# EAGLE design Beta22 (EAGLE 7.4.0)
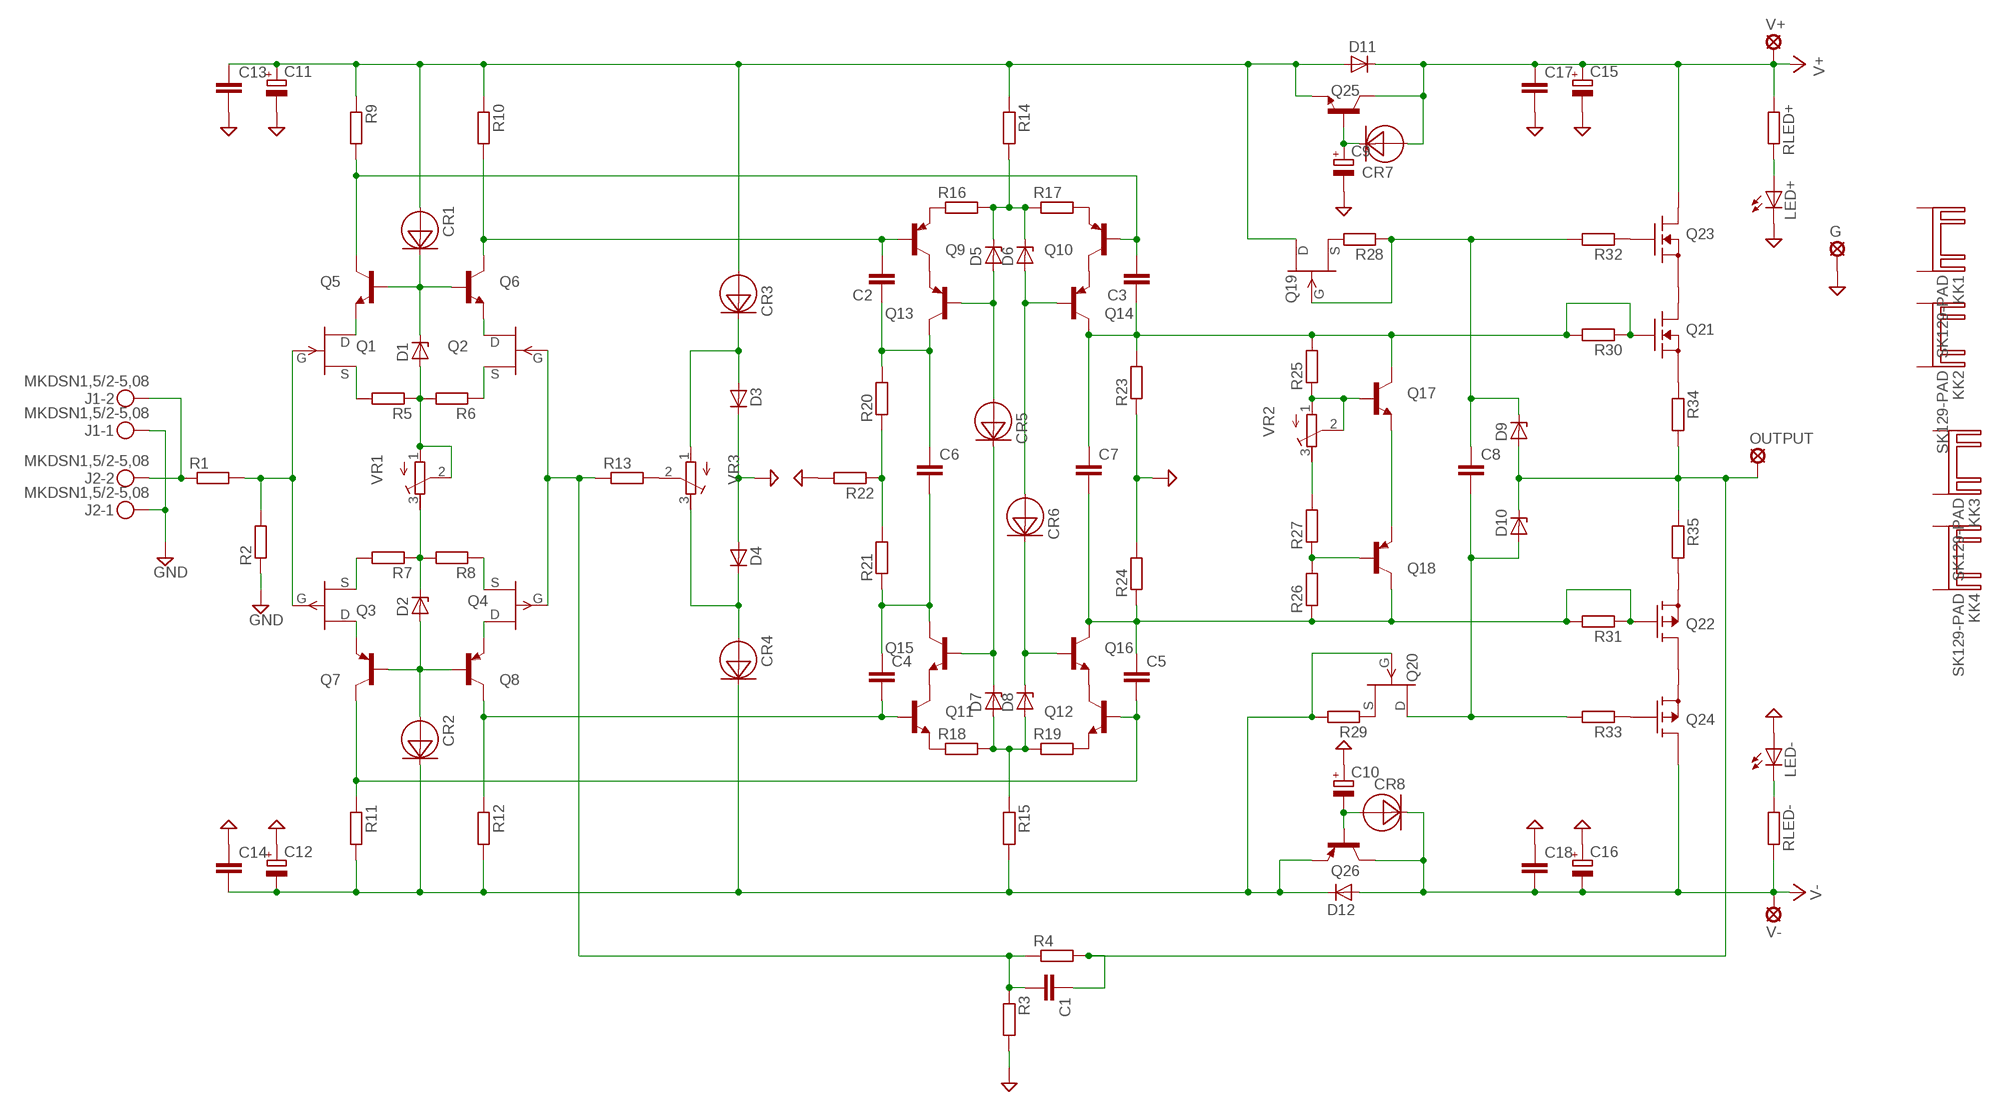
[diagram p0: schematic, sheet 1]

## Parts
C1  C-EU025_050-025X075  [C025_050-025X075]
C2  C-EU025_050-025X075  [C025_050-025X075]
C3  C-EU025_050-025X075  [C025_050-025X075]
C4  C-EU025_050-025X075  [C025_050-025X075]
C5  C-EU025_050-025X075  [C025_050-025X075]
C6  C-EU050-055X075  [C050-055X075]
C7  C-EU050-055X075  [C050-055X075]
C8  C-EU050-055X075  [C050-055X075]
C9  CPOL-EUE5-13  [E5-13]
C10  CPOL-EUE5-13  [E5-13]
C11  CPOL-EUE5-13  [E5-13]
C12  CPOL-EUE5-13  [E5-13]
C13  C-EU050-055X075  [C050-055X075]
C14  C-EU050-055X075  [C050-055X075]
C15  CPOL-EUE7.5-18  [E7,5-18]
C16  CPOL-EUE7.5-18  [E7,5-18]
C17  C-EU050-055X075  [C050-055X075]
C18  C-EU050-055X075  [C050-055X075]
CR1  E-202  [DO-35-3]
CR2  E-202  [DO-35-3]
CR3  E-202  [DO-35-3]
CR4  E-202  [DO-35-3]
CR5  E-202  [DO-35-3]
CR6  E-202  [DO-35-3]
CR7  E-202  [DO-35-3]
CR8  E-202  [DO-35-3]
D1  BZV10  [DO34Z7]
D2  BZV10  [DO34Z7]
D3  1N4148-V  [1N4148]
D4  1N4148-V  [1N4148]
D5  BZV10  [DO34Z7]
D6  BZV10  [DO34Z7]
D7  BZV10  [DO34Z7]
D8  BZV10  [DO34Z7]
D9  BZV10  [DO34Z7]
D10  BZV10  [DO34Z7]
D11  1N4148-V  [1N4148]
D12  1N4148-V  [1N4148]
G  SE14  [SE14]
J1  MKDSN1,5/2-5,08  [MKDSN1,5/2-5,08]
J2  MKDSN1,5/2-5,08  [MKDSN1,5/2-5,08]
KK1  SK129-PAD  [SK129]
KK2  SK129-PAD  [SK129]
KK3  SK129-PAD  [SK129]
KK4  SK129-PAD  [SK129]
LED+  LED5MM  [LED5MM]
LED-  LED5MM  [LED5MM]
OUTPUT  SE14  [SE14]
Q1  2SK170  [TO92-]
Q2  2SK170  [TO92-]
Q3  2SJ74BL  [TO92-]
Q4  2SJ74BL  [TO92-]
Q5  BC550  [TO92-EBC]
Q6  BC550  [TO92-EBC]
Q7  BC560  [TO92_1]
Q8  BC560  [TO92_1]
Q9  BC560  [TO92_1]
Q10  BC560  [TO92_1]
Q11  BC550  [TO92-EBC]
Q12  BC550  [TO92-EBC]
Q13  BC560  [TO92_1]
Q14  BC560  [TO92_1]
Q15  BC550  [TO92-EBC]
Q16  BC550  [TO92-EBC]
Q17  BC550  [TO92-EBC]
Q18  BC560  [TO92_1]
Q19  PN4392  [TO92-]
Q20  PN4392  [TO92-]
Q21  IRFZ24N  [TO220V]
Q22  IRFZ34N  [TO220V]
Q23  IRFZ24N  [TO220V]
Q24  IRFZ34N  [TO220V]
Q25  BC550  [TO92-EBC]
Q26  BC560  [TO92_1]
R1  R-EU_0309/10  [0309/10]
R2  R-EU_0309/10  [0309/10]
R3  R-EU_0309/10  [0309/10]
R4  R-EU_0309/10  [0309/10]
R5  R-EU_0309/10  [0309/10]
R6  R-EU_0309/10  [0309/10]
R7  R-EU_0309/10  [0309/10]
R8  R-EU_0309/10  [0309/10]
R9  R-EU_0309/10  [0309/10]
R10  R-EU_0309/10  [0309/10]
R11  R-EU_0309/10  [0309/10]
R12  R-EU_0309/10  [0309/10]
R13  R-EU_0309/10  [0309/10]
R14  R-EU_0309/10  [0309/10]
R15  R-EU_0309/10  [0309/10]
R16  R-EU_0309/10  [0309/10]
R17  R-EU_0309/10  [0309/10]
R18  R-EU_0309/10  [0309/10]
R19  R-EU_0309/10  [0309/10]
R20  R-EU_0309/10  [0309/10]
R21  R-EU_0309/10  [0309/10]
R22  R-EU_0309/10  [0309/10]
R23  R-EU_0309/10  [0309/10]
R24  R-EU_0309/10  [0309/10]
R25  R-EU_0309/10  [0309/10]
R26  R-EU_0309/10  [0309/10]
R27  R-EU_0309/10  [0309/10]
R28  R-EU_0309/10  [0309/10]
R29  R-EU_0309/10  [0309/10]
R30  R-EU_0309/10  [0309/10]
R31  R-EU_0309/10  [0309/10]
R32  R-EU_0309/10  [0309/10]
R33  R-EU_0309/10  [0309/10]
R34  R-EU_0617/17  [0617/17]
R35  R-EU_0617/17  [0617/17]
RLED+  R-EU_0309/10  [0309/10]
RLED-  R-EU_0309/10  [0309/10]
V+  SE14  [SE14]
V-  SE14  [SE14]
VR1  R-TRIMM3296W  [RTRIM3296W]
VR2  R-TRIMM3296W  [RTRIM3296W]
VR3  R-TRIMM3296W  [RTRIM3296W]

## Nets
GND: C9.- C10.+ C11.- C12.+ C13.2 C14.1 C15.- C16.+ C17.2 C18.1 D3.C D4.A G.MP J1.1 J2.1 LED+.K(C) LED-.A R2.1 R3.2 R22.2 R23.1 R24.2
N$1: Q1.2(G) Q3.2(G) R1.2 R2.2
N$2: Q2.1(D) Q6.E
N$3: Q1.3(S) R5.2
N$4: Q3.3(S) R7.2
N$5: Q1.1(D) Q5.E
N$6: Q3.1(D) Q7.3(E)
N$7: Q2.3(S) R6.1
N$8: D2.C R7.1 R8.2 VR1.3(E)
N$9: Q4.3(S) R8.1
N$10: Q4.1(D) Q8.3(E)
N$11: D1.A R5.1 R6.2 VR1.1(A) VR1.2(S)
N$12: CR2.ANODE D2.A Q7.2(B) Q8.2(B)
N$13: C3.2 C3.3 Q5.C Q10.2(B) R9.2
N$14: C2.2 C2.3 Q6.C Q9.2(B) R10.2
N$15: CR4.ANODE D4.C VR3.3(E)
N$16: CR1.1(CATHODE) CR1.2(CATHODE) CR1.CATHODE D1.C Q5.B Q6.B
N$17: C12.- C14.2 CR2.1(CATHODE) CR2.2(CATHODE) CR2.CATHODE CR4.1(CATHODE) CR4.2(CATHODE) CR4.CATHODE D12.C Q20.1(G) Q26.3(E) R11.2 R12.2 R15.2 R29.2
N$18: C5.2 C5.3 Q7.1(C) Q12.B R11.1
N$19: J1.2 J2.2 R1.1
N$20: C8.2 D10.A Q20.3(D) R33.2
N$21: C1.2 C1.3 Q2.2(G) Q4.2(G) R3.1 R4.1 R13.1
N$22: R13.2 VR3.2(S)
N$23: Q9.1(C) Q13.3(E)
N$24: CR3.1(CATHODE) CR3.2(CATHODE) CR3.CATHODE D3.A VR3.1(A)
N$25: Q10.1(C) Q14.3(E)
N$26: C1.1 D9.A D10.C OUTPUT.MP R4.2 R34.2 R35.1
N$27: Q9.3(E) R16.1
N$28: Q10.3(E) R17.2
N$29: D5.C D6.C R14.2 R16.2 R17.1
N$30: Q11.E R18.1
N$31: Q12.E R19.2
N$32: D7.A D8.A R15.1 R18.2 R19.1
N$33: C4.2 C4.3 Q8.1(C) Q11.B R12.1
N$34: R20.1 R21.2 R22.1
N$35: C2.1 C6.1 Q13.1(C) R20.2
N$36: C4.1 C6.2 Q15.C R21.1
N$37: Q11.C Q15.E
N$38: Q12.C Q16.E
N$39: Q17.B R25.1 VR2.1(A) VR2.2(S)
N$40: Q19.2(S) R28.2
N$41: Q20.2(S) R29.1
N$42: C3.1 C7.1 Q14.1(C) Q17.C Q21.1(G) R23.2 R25.2 R30.1 R30.2
N$43: CR5.ANODE D5.A Q13.2(B)
N$44: CR6.ANODE D6.A Q14.2(B)
N$45: CR5.1(CATHODE) CR5.2(CATHODE) CR5.CATHODE D7.C Q15.B
N$46: CR6.1(CATHODE) CR6.2(CATHODE) CR6.CATHODE D8.C Q16.B
N$47: Q18.2(B) R26.2 R27.1
N$48: R27.2 VR2.3(E)
N$49: Q17.E Q18.3(E)
N$50: C5.1 C7.2 Q16.C Q18.1(C) Q22.1(G) R24.1 R26.1 R31.1 R31.2
N$51: C11.+ C13.1 CR1.ANODE CR3.ANODE D11.A Q19.3(D) Q25.E R9.1 R10.1 R14.1
N$52: C10.- CR8.ANODE Q26.2(B)
N$54: C8.1 D9.C Q19.1(G) R28.1 R32.2
N$57: Q21.2(D) Q23.3(S)
N$58: Q22.2(D) Q24.3(S)
N$59: Q23.1(G) R32.1
N$60: Q24.1(G) R33.1
N$61: LED+.A RLED+.2
N$62: Q21.3(S) R34.1
N$63: Q22.3(S) R35.2
N$66: C9.+ CR7.1(CATHODE) CR7.2(CATHODE) CR7.CATHODE Q25.B
N$67: LED-.K(C) RLED-.1
V+: C15.+ C17.1 CR7.ANODE D11.C Q23.2(D) Q25.C RLED+.1 V+.MP
V-: C16.- C18.2 CR8.1(CATHODE) CR8.2(CATHODE) CR8.CATHODE D12.A Q24.2(D) Q26.1(C) RLED-.2 V-.MP
Unconnected: KK1.A2,5(K) KK1.B2,5(K) KK2.A2,5(K) KK2.B2,5(K) KK3.A2,5(K) KK3.B2,5(K) KK4.A2,5(K) KK4.B2,5(K)

## Library data of the parts
C1-C8 C13 C14 C17 C18 = Vwvwbg:C-EU: CAPACITOR, European symbol
C9-C12 C15 C16 = Vwvwbg:CPOL-EU: POLARIZED CAPACITOR, European symbol
CR1-CR8 = crd:E-202
D1 D2 D5-D10 = diode:BZV10: Z DIODE
D3 D4 D11 D12 = diode:1N4148-V
G OUTPUT V+ V- = solpad:SE14: SOLDER PAD E1553, drill 1,4mm, distributor Buerklin, 07F820
J1 J2 = con-phoenix-508:MKDSN1,5/2-5,08: MKDSN 1,5/ 2-5,08 Printklemme Nennstrom: 13,5 A Nennspannung: 250 V Rastermaß: 5,08 mm Polzahl: 2 Anschlussart: Schraubanschluss Montage: Löten Anschlussrichtung Leiter/Platine: 0 ° Artikelnummer: 1729128 Source: http://eshop.phoenixcontact.com .. 1729128.pdf
KK1-KK4 = heatsinkfix:SK129-PAD: HEATSINK manufacturer Fischer/distributor Buerklin
LED+ LED- = led:LED: LED OSRAM: - CHIPLED LG R971, LG N971, LY N971, LG Q971, LY Q971, LO R971, LY R971 LH N974, LH R974 LS Q976, LO Q976, LY Q976 LO Q996 - Hyper CHIPLED LW Q18S LB Q993, LB Q99A, LB R99A - SideLED LS A670, LO A670, LY A670, LG A670, LP A670 LB A673, LV A673, LT A673, LW A673 LH A674 LY A675 LS A676, LA A676, LO A676, LY A676, LW A676 LS A679, LY A679, LG A679 - Hyper Micro SIDELED® LS Y876, LA Y876, LO Y876, LY Y876 LT Y87S - SmartLED LW L88C, LW L88S LB L89C, LB L89S, LG L890 LS L89K, LO L89K, LY L89K LS L896, LA L896, LO L896, LY L896 - TOPLED LS T670, LO T670, LY T670, LG T670, LP T670 LSG T670, LSP T670, LSY T670, LOP T670, LYG T670 LG T671, LOG T671, LSG T671 LB T673, LV T673, LT T673, LW T673 LH T674 LS T676, LA T676, LO T676, LY T676, LB T676, LH T676, LSB T676, LW T676 LB T67C, LV T67C, LT T67C, LS T67K, LO T67K, LY T67K, LW E67C LS E67B, LA E67B, LO E67B, LY E67B, LB E67C, LV E67C, LT E67C LW T67C LS T679, LY T679, LG T679 LS T770, LO T770, LY T770, LG T770, LP T770 LB T773, LV T773, LT T773, LW T773 LH T774 LS E675, LA E675, LY E675, LS T675 LS T776, LA T776, LO T776, LY T776, LB T776 LHGB T686 LT T68C, LB T68C - Hyper Mini TOPLED® LB M676 - Mini TOPLED Santana® LG M470 LS M47K, LO M47K, LY M47K Source: http://www.osram.convergy.de LUXEON: - LUMILED® LXK2-PW12-R00, LXK2-PW12-S00, LXK2-PW14-U00, LXK2-PW14-V00 LXK2-PM12-R00, LXK2-PM12-S00, LXK2-PM14-U00 LXK2-PE12-Q00, LXK2-PE12-R00, LXK2-PE12-S00, LXK2-PE14-T00, LXK2-PE14-U00 LXK2-PB12-K00, LXK2-PB12-L00, LXK2-PB12-M00, LXK2-PB14-N00, LXK2-PB14-P00, LXK2-PB14-Q00 LXK2-PR12-L00, LXK2-PR12-M00, LXK2-PR14-Q00, LXK2-PR14-R00 LXK2-PD12-Q00, LXK2-PD12-R00, LXK2-PD12-S00 LXK2-PH12-R00, LXK2-PH12-S00 LXK2-PL12-P00, LXK2-PL12-Q00, LXK2-PL12-R00 Source: www.luxeon.com KINGBRIGHT: KA-3528ASYC Source: www.kingbright.com
Q1 Q2 = tranzistory FET:2SK170: N-Channel Junction FET
Q3 Q4 = tranzistory FET:2SJ74BL
Q5 Q6 Q11 Q12 Q15-Q17 Q25 = transistor-npn:BC550*: NPN Transistor
Q7-Q10 Q13 Q14 Q18 Q26 = tranzistory PNP:BC560*: PNP Transistror
Q19 Q20 = tranzistory FET:PN4392
Q21 Q23 = transistor-fet:IRFZ24N
Q22 Q24 = transistor-fet:IRFZ34N
R1-R35 RLED+ RLED- = Vwvwbg:R-EU_: RESISTOR, European symbol
VR1-VR3 = resistor:R-TRIMM: Trimm resistor

## Board
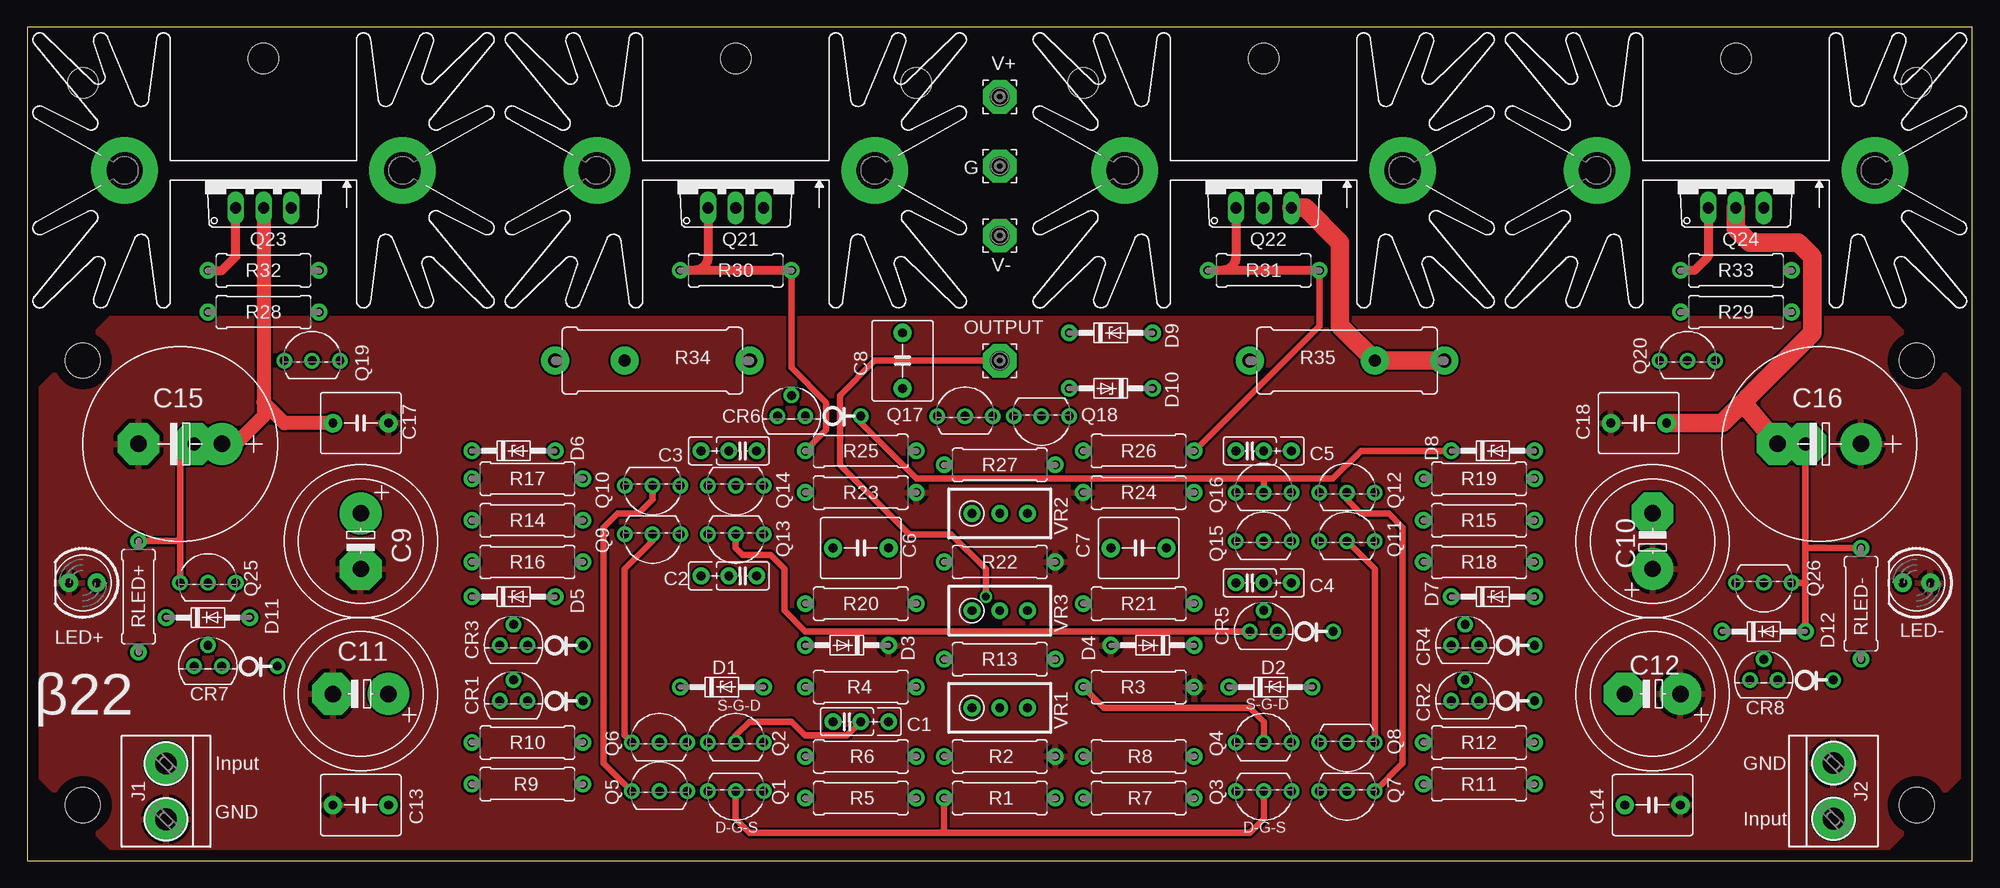
[diagram p1: board, top side]
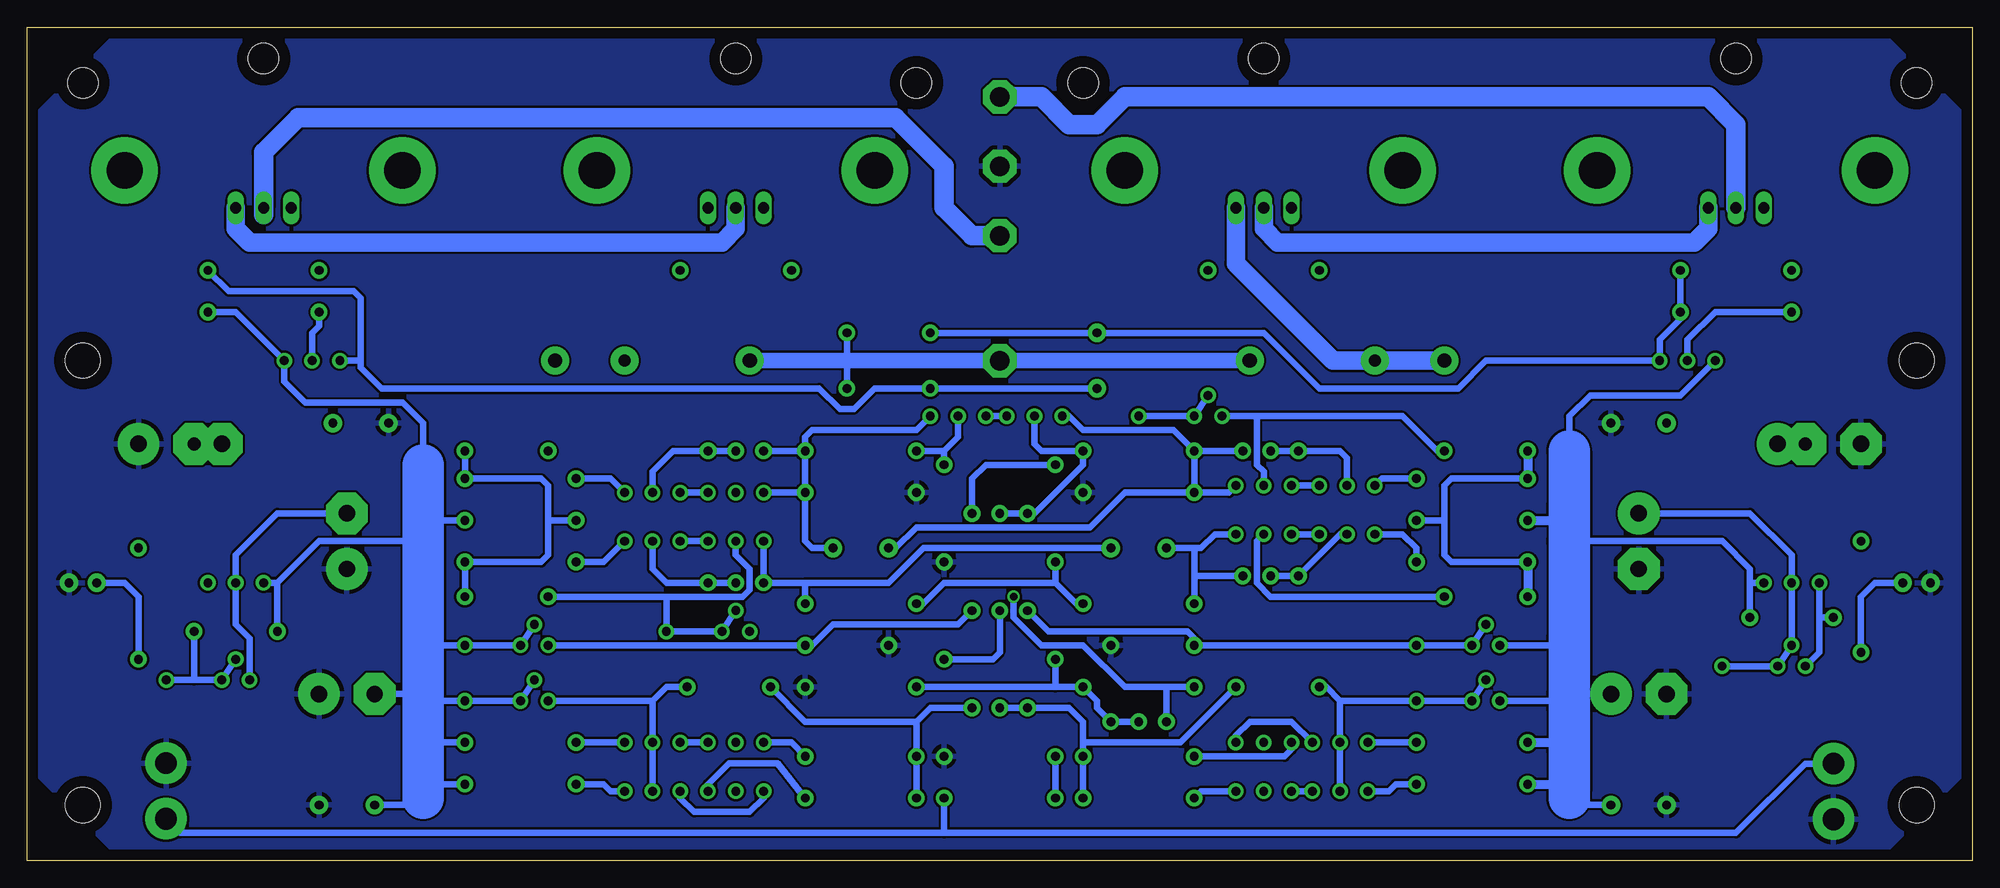
[diagram p2: board, bottom side, seen from below]

Size 177.8 x 76.2 mm. Coordinates in mm from the lower left corner, seen from the top.
Outline: 0,0 177.8,0 177.8,76.2 0,76.2 0,0
Copper layers (1*16): Top 0.035mm / dielectric 1.5mm / Bottom 0.035mm
Design rules "default *": minimum track width 10mil, minimum drill 24mil, track to track 8mil, track to pad 8mil, pad to pad 8mil, via to via 8mil, smd to smd 8mil, copper to edge 40mil, drill to drill 8mil, minimum pad ring 10mil, minimum via ring 8mil, stop-mask expansion 4mil, vias tented up to drill 0mil, thermal gap 15mil
Holes 3.2 mm at 5.08,5.08 172.72,5.08 5.08,45.72 172.72,45.72
Holes 2.8 mm at 5.08,71.12 21.59,73.34 64.77,73.34 113.03,73.34 156.21,73.34 172.72,71.12 81.28,71.12 96.52,71.12

### Footprints (pad centres in the part's own frame; a part is rotated, then mirrored left to right if it is on the bottom)
C025_050-025X075 = drill 0.813 pad 1.524: 1 -1.27,0; 2 1.27,0; 3 3.81,0
C050-055X075 = drill 0.813 pad 1.676: 1 -2.54,0; 2 2.54,0
E5-13 = drill 1.5 pad 3.81: + -2.54,0 | drill 1.5 pad 3.81 octagon: - 2.54,0
E7,5-18 = drill 1.5 pad 3.81: + -3.81,0 | drill 1.5 pad 3.81 octagon: - 3.81,0
DO-35-3 = drill 0.813 pad 1.422: 1 -1.27,0; 2 -2.54,1.905; ANODE -3.81,0; CATHODE 3.81,0
DO34Z7 = drill 0.813 pad 1.524: A 3.81,0; C -3.81,0
1N4148 = drill 0.813 pad 1.524: A 3.81,0; C -3.81,0
SE14 = drill 1.778 pad 3.048 octagon: MP 0,0
MKDSN1,5/2-5,08 = drill 2 pad 3.81: 1 -2.561,0.025; 2 2.519,0.025
SK129 = drill 3.302 pad 6.096: A2,5 -12.7,-0.889; B2,5 12.7,-0.889
LED5MM = drill 0.813 pad 1.676: A -1.27,0; K 1.27,0
TO92- = drill 0.813 pad 1.422: 1 2.54,0; 2 0,0; 3 -2.54,0
TO92-EBC = drill 0.813 pad 1.422: B 0,-1.27; C -2.54,-1.27; E 2.54,-1.27
TO92_1 = drill 0.813 pad 1.422: 1 -2.54,0; 2 0,0; 3 2.54,0
TO220V = drill 1.016 long: 1 -2.54,-2.54; 2 0,-2.54; 3 2.54,-2.54
0309/10 = drill 0.813 pad 1.524: 1 -5.08,0; 2 5.08,0
0617/17 = drill 1.3 pad 2.54: 1 -8.89,0; 2 8.89,0
RTRIM3296W = drill 0.8 pad 1.524: 1 0,-2.54; 2 0,0; 3 0,2.54

### Placement (x,y rotation side)
C1  74.93,12.7 0 top
C2  65.41,26.04 180 top
C3  65.41,37.47 180 top
C4  111.76,25.4 0 top
C5  111.76,37.47 0 top
C6  76.2,28.57 0 top
C7  101.6,28.57 0 top
C8  80.01,45.72 270 top
C9  30.48,29.21 270 top
C10  148.59,29.21 90 top
C11  30.48,15.24 180 top
C12  148.59,15.24 180 top
C13  30.48,5.08 180 top
C14  148.59,5.08 180 top
C15  13.97,38.1 180 top
C16  163.83,38.1 180 top
C17  30.48,40.01 0 top
C18  147.32,40.01 0 top
CR1  46.99,14.61 0 top
CR2  133.99,14.61 0 top
CR3  46.99,19.68 0 top
CR4  133.99,19.68 0 top
CR5  115.57,20.95 0 top
CR6  72.39,40.64 0 top
CR7  19.05,17.78 0 top
CR8  161.29,16.51 0 top
D1  63.5,15.88 0 top
D2  113.67,15.88 0 top
D3  74.93,19.68 180 top
D4  102.87,19.68 180 top
D5  44.45,24.13 0 top
D6  44.45,37.47 0 top
D7  133.99,24.13 0 top
D8  133.99,37.47 0 top
D9  99.06,48.26 0 top
D10  99.06,43.18 180 top
D11  16.51,22.23 0 top
D12  158.75,20.95 0 top
G  88.9,63.5 0 top
J1  12.7,6.35 90 top
J2  165.1,6.35 270 top
KK1  156.21,62.23 180 top
KK2  113.03,62.23 180 top
KK3  64.77,62.23 180 top
KK4  21.59,62.23 180 top
LED+  5.08,25.4 180 top
LED-  172.72,25.4 180 top
OUTPUT  88.9,45.72 0 top
Q1  64.77,6.35 180 top
Q2  64.77,10.79 0 top
Q3  113.03,6.35 180 top
Q4  113.03,10.79 0 top
Q5  57.78,7.62 0 top
Q6  57.78,12.06 0 top
Q7  120.65,6.35 180 top
Q8  120.65,10.79 180 top
Q9  57.15,29.84 180 top
Q10  57.15,34.29 180 top
Q11  120.65,30.48 0 top
Q12  120.65,34.92 0 top
Q13  64.77,29.84 180 top
Q14  64.77,34.29 180 top
Q15  113.03,30.48 0 top
Q16  113.03,34.92 0 top
Q17  85.72,41.91 0 top
Q18  92.71,40.64 180 top
Q19  26.04,45.72 0 top
Q20  151.76,45.72 0 top
Q21  64.77,62.23 0 top
Q22  113.03,62.23 0 top
Q23  21.59,62.23 0 top
Q24  156.21,62.23 0 top
Q25  16.51,26.67 0 top
Q26  158.75,25.4 180 top
R1  88.9,5.71 180 top
R2  88.9,9.53 180 top
R3  101.6,15.88 0 top
R4  76.2,15.88 180 top
R5  76.2,5.71 180 top
R6  76.2,9.53 0 top
R7  101.6,5.71 0 top
R8  101.6,9.53 180 top
R9  45.72,6.99 0 top
R10  45.72,10.79 0 top
R11  132.72,6.99 0 top
R12  132.72,10.79 0 top
R13  88.9,18.41 0 top
R14  45.72,31.11 0 top
R15  132.72,31.11 0 top
R16  45.72,27.3 180 top
R17  45.72,34.92 0 top
R18  132.72,27.3 0 top
R19  132.72,34.92 180 top
R20  76.2,23.5 180 top
R21  101.6,23.5 180 top
R22  88.9,27.3 0 top
R23  76.2,33.66 180 top
R24  101.6,33.66 180 top
R25  76.2,37.47 180 top
R26  101.6,37.47 180 top
R27  88.9,36.2 180 top
R28  21.59,50.16 180 top
R29  156.21,50.16 0 top
R30  64.77,53.98 0 top
R31  113.03,53.98 0 top
R32  21.59,53.98 0 top
R33  156.21,53.98 0 top
R34  57.15,45.72 0 top
R35  120.65,45.72 0 top
RLED+  10.16,24.13 270 top
RLED-  167.64,23.5 90 top
V+  88.9,69.85 0 top
V-  88.9,57.15 0 top
VR1  88.9,13.97 270 top
VR2  88.9,31.75 270 top
VR3  88.9,22.86 270 top

### Tracks (layer width: path | path; a pad name or v marks a point on that pad's centre or on a via)
GND
  pour Bottom: 0,8.89 8.89,0 168.91,0 177.8,8.89 177.8,67.31 168.91,76.2 8.89,76.2 0,67.31
  pour Top: 7.62,49.53 0,41.91 0,8.89 8.89,0 168.91,0 177.8,8.89 177.8,41.91 170.18,49.53
N$1
  Top 0.61: Q1.2 64.77,3.81 66.04,2.54 83.82,2.54 | 83.82,2.54 111.76,2.54 113.03,3.81 Q3.2 | R1.2 83.82,2.54
  Bottom 0.61: R2.2 R1.2
N$2
  Bottom 0.61: Q2.1 67.31,11.43 66.04,12.7 62.23,12.7 Q6.E
N$3
  Bottom 0.61: Q1.3 70.48,6.35 R5.2
N$4
  Bottom 0.61: R7.2 109.22,8.89 113.67,8.89 115.57,6.99 Q3.3
N$5
  Bottom 0.61: Q5.E Q1.1
N$6
  Bottom 0.61: Q3.1 110.49,5.71 111.76,4.45 116.84,4.45 118.11,5.71 Q7.3
N$7
  Bottom 0.61: Q2.3 62.23,10.16 62.87,9.53 R6.1
N$8
  Bottom 0.61: R7.1 R8.2 96.52,12.7 | VR1.3 95.25,13.97 96.52,12.7 | D2.C 106.68,12.7 96.52,12.7
N$9
  Bottom 0.61: R8.1 107.95,10.79 Q4.3
N$10
  Bottom 0.61: Q4.1 Q8.3
N$11
  Bottom 0.61: R5.1 R6.2 81.28,10.79 | VR1.2 VR1.1 82.55,13.97 81.28,12.7 81.28,10.79 | D1.A 72.39,10.79 81.28,10.79
N$12
  Bottom 0.61: Q7.2 Q8.2 120.65,14.61 | 120.65,14.61 119.38,15.88 D2.A | 120.65,14.61 CR2.ANODE
N$13
  Top 0.61: Q10.2 57.15,33.02 55.88,31.75 53.98,31.75 52.7,30.48 52.7,8.89 Q5.C
  Bottom 0.61: R9.2 52.7,6.99 53.34,6.35 Q5.C | Q10.2 57.15,36.83 57.78,37.47 C3.3 C3.2
N$14
  Top 0.61: Q9.2 57.15,29.21 54.61,26.67 54.61,11.43 Q6.C
  Bottom 0.61: R10.2 Q6.C | C2.2 C2.3 57.78,29.84 Q9.2
N$15
  Bottom 0.61: CR4.ANODE D4.C 106.05,19.68 104.14,21.59 92.71,21.59 VR3.3
N$16
  Bottom 0.61: 57.78,14.61 CR1.CATHODE CR1.1 CR1.2 | 57.78,14.61 59.05,15.88 D1.C | 57.78,14.61 Q6.B Q5.B
N$17
  Bottom 0.61: R29.2 158.75,50.16 Q20.1 154.31,43.81 152.4,41.91 143.51,41.91 141.6,40.01 141.6,36.2 | C12.- 141.6,15.24 140.97,14.61 CR2.CATHODE CR2.1 CR2.2 | Q26.3 154.94,25.4 | CR4.2 CR4.1 CR4.CATHODE 141.6,19.68 | R15.2 140.97,31.11 141.6,31.75 | R12.2 140.97,10.79 141.6,13.34 | R11.2 140.34,6.99 141.6,8.26 | D12.C 154.94,25.4 | 154.94,25.4 151.13,29.21 141.6,29.21 | C14.2 142.24,5.08 142.24,5.71 141.6,6.35
  Bottom 3.81: 141.6,36.2 141.6,31.75 141.6,29.21 141.6,19.68 141.6,15.24 141.6,13.34 141.6,8.26 141.6,6.35 141.6,5.71
N$18
  Top 0.61: Q7.1 125.73,8.89 125.73,30.48 124.46,31.75 121.92,31.75 120.65,33.02 Q12.B
  Bottom 0.61: Q7.1 124.46,6.35 125.09,6.99 R11.1 | Q12.B 120.65,35.56 118.75,37.47 C5.3 C5.2
N$19
  Bottom 0.61: R1.1 93.98,2.54 | 93.98,2.54 163.83,2.54 J2.2 | J1.2 15.26,8.87 21.59,2.54 93.98,2.54
N$20
  Bottom 0.61: R33.2 159.38,52.07 147.96,52.07 147.32,51.44 147.32,45.72 | Q20.3 147.32,45.72 | 147.32,45.72 147.32,45.09 145.41,43.18 105.41,43.18 103.5,41.27 102.23,41.27 100.33,43.18 D10.A C8.2
N$21
  Top 0.61: Q4.2 113.03,12.7 111.76,13.97 98.42,13.97 R3.1 | Q2.2 64.77,11.43 66.04,12.7 69.85,12.7 71.12,11.43 74.93,11.43 C1.2
  Bottom 0.61: C1.2 C1.3 80.01,13.97 80.01,14.61 R4.1 83.82,15.88 | 83.82,15.88 R3.1 | R13.1 83.82,15.88
N$22
  Bottom 0.61: VR3.2 88.9,19.05 89.53,18.41 R13.2
N$23
  Bottom 0.61: Q9.1 Q13.3
N$24
  Bottom 0.61: CR3.2 CR3.1 CR3.CATHODE D3.A 71.12,20.32 71.75,20.95 84.45,20.95 VR3.1
N$25
  Bottom 0.61: Q10.1 Q14.3
N$26  (via drill 0.7 pad 0.3)
  Top 0.61: v87.63,24.13 87.63,26.67 84.45,29.84 80.64,29.84 74.3,36.2 74.3,42.55 77.47,45.72 OUTPUT.MP
  Bottom 0.61: C1.1 73.66,15.88 | R4.2 73.66,15.88 | 73.66,15.88 77.47,15.88 81.28,19.68 85.09,19.68 87.63,22.23 v87.63,24.13 | D9.A 102.87,45.72 D10.C
  Bottom 1.422: R35.1 102.87,45.72 OUTPUT.MP R34.2
N$27
  Bottom 0.61: R16.1 50.8,28.57 52.07,29.84 Q9.3
N$28
  Bottom 0.61: R17.2 53.98,34.92 Q10.3
N$29
  Bottom 0.61: R17.1 47.62,34.92 48.26,34.29 48.26,31.11 | 48.26,31.11 48.26,27.94 47.62,27.3 R16.2 | R14.2 48.26,31.11
  Bottom 0.813: D6.C R17.1 | R16.2 D5.C
N$30
  Bottom 0.61: R18.1 125.09,27.3 Q11.E
N$31
  Bottom 0.61: Q12.E 124.46,34.92 R19.2
N$32
  Bottom 0.61: D8.A R19.1 130.81,34.92 130.18,34.29 130.18,31.11 | 130.18,31.11 130.18,27.94 130.81,27.3 R18.2 D7.A | R15.1 130.18,31.11
N$33
  Top 0.61: Q11.B 123.19,26.67 Q8.1
  Bottom 0.61: Q8.1 R12.1 | C4.2 C4.3 119.38,25.4 120.65,26.67 Q11.B
N$34
  Bottom 0.61: R22.1 83.82,25.4 | 83.82,25.4 81.92,23.5 R20.1 | R21.2 95.89,23.5 93.98,25.4 83.82,25.4
N$35
  Bottom 0.61: Q13.1 69.22,29.84 70.48,28.57 71.12,28.57 | 71.12,28.57 C6.1 | R20.2 71.12,26.04 | 71.12,26.04 71.12,28.57 | C2.1 71.12,26.04
N$36
  Bottom 0.61: 106.68,25.4 C4.1 Q15.C | R21.1 106.68,25.4 | C6.2 95.89,28.57 99.06,25.4 106.68,25.4
N$37
  Bottom 0.61: Q11.C Q15.E
N$38
  Bottom 0.61: Q12.C Q16.E
N$39
  Bottom 0.61: VR2.2 VR2.1 85.72,31.75 81.28,36.2 R25.1 85.09,37.47 85.72,38.1 Q17.B
N$40
  Bottom 0.61: R28.2 23.5,50.16 26.04,47.62 Q19.2
N$41
  Bottom 0.61: Q20.2 151.76,48.26 151.13,48.9 R29.1
N$42
  Top 0.61: R30.2 69.85,45.09 73.03,41.91 73.03,39.37 R25.2
  Top 0.813: Q21.1 62.23,55.24 arc-90 60.96,53.98 R30.1 R30.2
  Bottom 0.61: Q14.1 67.94,33.66 R23.2 | R23.2 R25.2 | C3.1 R25.2 | C7.1 98.42,28.57 96.52,30.48 80.64,30.48 77.47,33.66 R23.2 | Q17.C 82.55,40.64 81.28,39.37 73.03,39.37 R25.2
N$43
  Top 0.61: CR5.ANODE 71.12,20.95 69.22,22.86 69.22,26.67 67.94,27.94 65.41,27.94 64.77,28.57 Q13.2
  Bottom 0.61: D5.A 64.14,24.13 65.41,25.4 65.41,29.21 Q13.2
N$44
  Bottom 0.61: D6.A 48.9,37.47 52.07,40.64 65.41,40.64 | 65.41,40.64 CR6.ANODE | Q14.2 64.77,35.56 65.41,36.2 65.41,40.64
N$45
  Bottom 0.61: CR5.2 CR5.1 CR5.CATHODE 119.38,24.13 | D7.C 119.38,24.13 | 119.38,24.13 112.39,24.13 111.76,24.77 111.76,26.67 113.03,27.94 Q15.B
N$46
  Top 0.61: CR6.CATHODE 76.2,40.01 81.28,34.92 113.03,34.92 | D8.C 121.92,37.47 119.38,34.92 113.03,34.92 | Q16.B 113.03,34.92
  Bottom 0.61: CR6.2 CR6.1 CR6.CATHODE
N$47
  Bottom 0.61: R26.2 93.98,37.47 | R27.1 93.98,37.47 | 93.98,37.47 92.71,38.73 Q18.2
N$48
  Bottom 0.61: VR2.3 91.44,34.92 90.17,36.2 R27.2
N$49
  Bottom 0.61: Q17.E Q18.3
N$50
  Top 0.61: R31.2 118.11,48.9 R26.1
  Top 0.813: Q22.1 110.49,55.24 arc-90 109.22,53.98 R31.1 R31.2
  Bottom 0.61: Q18.1 96.52,39.37 106.05,39.37 106.68,38.73 R26.1 | C5.1 R26.1 | R26.1 R24.1 | R24.1 Q16.C | R24.1 106.68,29.21 106.05,28.57 C7.2
N$51
  Bottom 0.61: Q19.3 26.67,42.55 34.92,42.55 36.83,40.64 36.83,37.47 | 38.1,6.99 36.83,6.35 36.83,5.08 C13.1 | 38.1,10.79 36.83,10.16 | C11.+ 36.83,15.24 37.47,14.61 | CR1.ANODE 38.1,14.61 36.83,13.97 | CR3.ANODE 38.1,19.68 36.83,20.32 | 38.1,31.11 36.83,32.38 | D11.A 20.32,25.4 | 20.32,25.4 20.32,26.67 22.86,29.21 36.83,29.21 | Q25.E 20.32,25.4
  Bottom 0.813: R9.1 38.1,6.99 | R10.1 38.1,10.79 | R14.1 38.1,31.11
  Bottom 3.81: 36.83,37.47 36.83,32.38 36.83,29.21 36.83,20.32 36.83,15.24 36.83,13.97 36.83,10.16 36.83,6.35 36.83,5.71
N$52
  Bottom 0.61: CR8.ANODE 157.48,20.32 158.75,21.59 Q26.2 158.75,27.94 154.94,31.75 C10.-
N$54
  Bottom 0.61: R32.2 R28.1 26.67,49.53 28.57,47.62 Q19.1 44.45,45.72 46.99,43.18 59.69,43.18 64.77,48.26 C8.1 D9.C
N$57
  Bottom 1.676: Q23.3 24.13,57.78 25.4,56.52 63.5,56.52 64.77,57.78 Q21.2
N$58
  Bottom 1.676: Q22.2 113.03,57.78 114.3,56.52 157.48,56.52 158.75,57.78 Q24.3
N$59
  Top 0.813: R32.1 17.78,53.98 19.05,55.24 Q23.1
N$60
  Top 0.813: Q24.1 153.67,55.24 152.4,53.98 R33.1
N$61
  Bottom 0.61: RLED+.2 10.16,24.13 8.89,25.4 LED+.A
N$62  (via drill 1.1 pad 2.54)
  Bottom 1.676: Q21.3 67.31,54.61 58.42,45.72 v54.61,45.72 R34.1
N$63  (via drill 1.1 pad 2.54)
  Top 1.676: R35.2 v123.19,45.72 120.02,48.9 120.02,56.52 116.84,59.69 Q22.3
N$66
  Bottom 0.61: C9.+ 20.32,31.75 16.51,27.94 Q25.B CR7.2 CR7.1 CR7.CATHODE
N$67
  Bottom 0.61: RLED-.1 167.64,24.13 168.91,25.4 LED-.K
V+  (via drill 1.2 pad 3.81)
  Top 0.61: 13.97,29.21 13.97,36.83 v15.24,38.1 | 13.97,29.21 Q25.C | RLED+.1 13.97,29.21
  Top 1.016: v15.24,38.1 C15.+
  Top 1.27: Q23.2 21.59,41.91 | 21.59,41.91 21.59,40.64 19.05,38.1 C15.+ | C17.1 23.5,40.01 21.59,41.91
  Bottom 0.61: Q25.C 13.97,22.23 | 13.97,22.23 13.97,19.05 CR7.ANODE | D11.C 13.97,22.23
  Bottom 1.778: V+.MP 85.09,69.85 82.55,67.31 80.01,67.31 77.47,69.85 24.13,69.85 21.59,67.31 Q23.2
V-  (via drill 1.2 pad 3.81)
  Top 0.61: D12.A 162.56,25.4 | Q26.1 162.56,25.4 | 162.56,25.4 162.56,28.57 | RLED-.2 162.56,28.57 | 162.56,28.57 v162.56,38.1 C16.-
  Top 1.27: 156.84,41.91 157.16,42.23
  Top 1.676: 157.16,42.23 163.19,48.26 163.19,55.24 161.93,56.52 157.48,56.52 156.21,57.78 Q24.2 | C18.2 154.94,40.01 156.84,41.91 C16.-
  Bottom 0.61: 162.56,16.51 CR8.1 CR8.2 | 162.56,16.51 CR8.CATHODE | D12.A 162.56,16.51
  Bottom 1.778: V-.MP 91.44,57.15 93.98,59.69 93.98,63.5 98.42,67.94 153.03,67.94 156.21,64.77 Q24.2 156.21,59.05

### Text on the board
tPlace: S-G-D | S-G-D | β22 | Input | GND | GND | D-G-S | D-G-S | Input